# Altium schematic sheet Sheet2.SchDoc
size A4; SheetNumber: 3; SheetTotal: 3
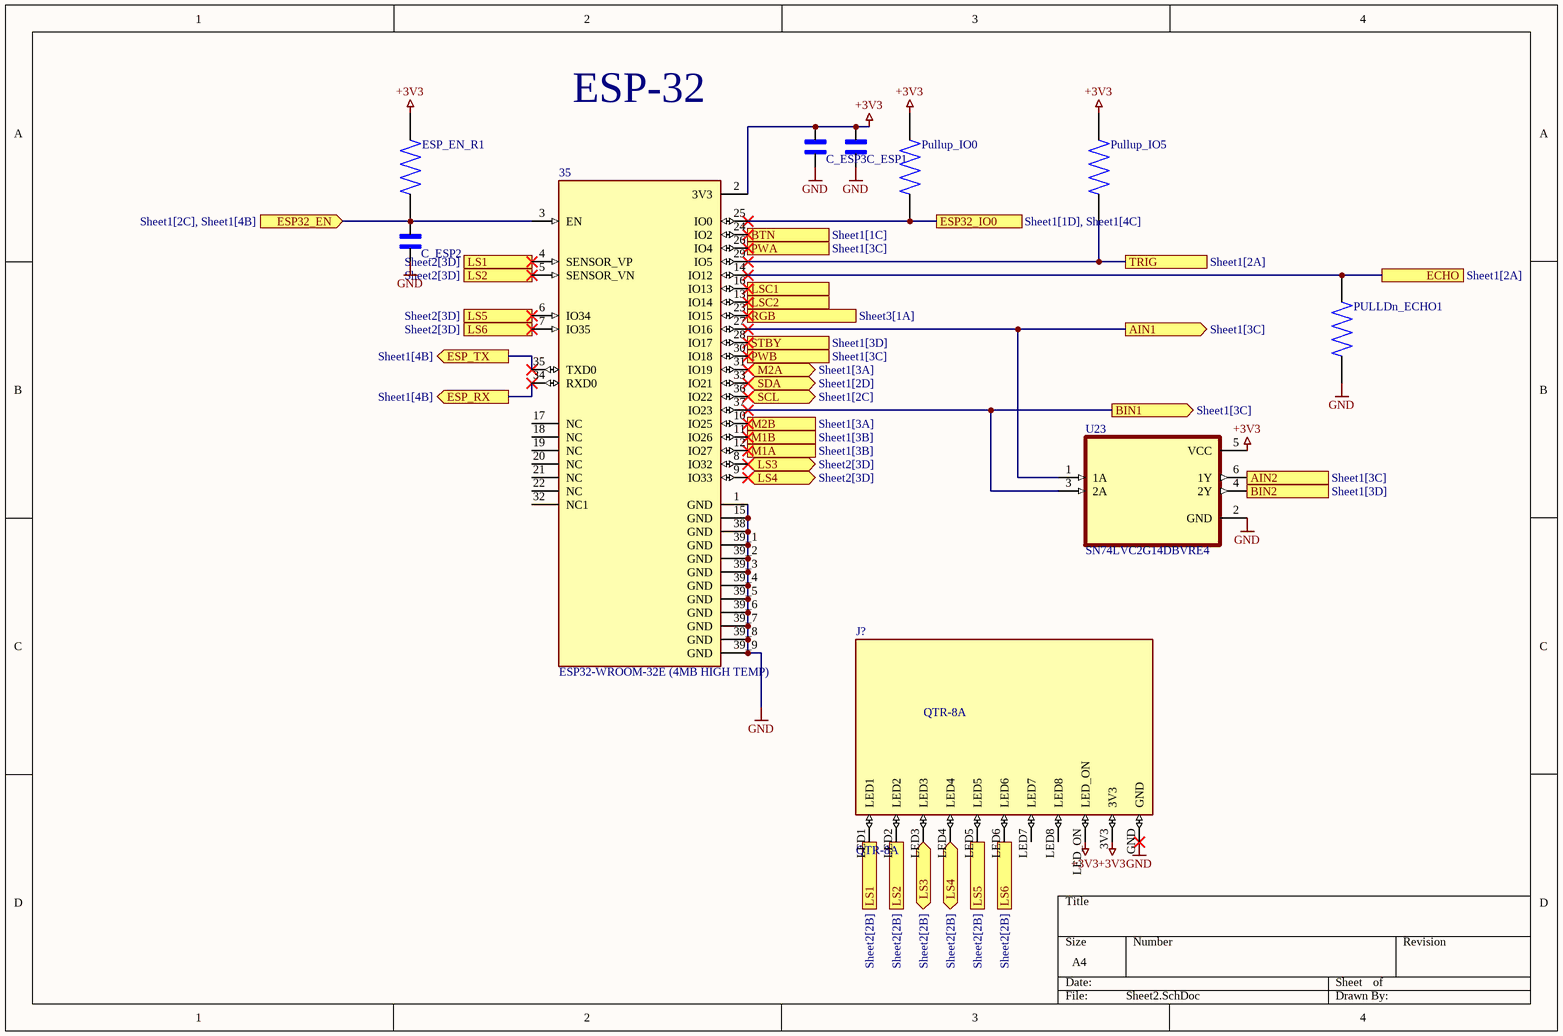
[diagram p0: Sheet2.SchDoc]

## Parts
35  ESP32-WROOM-32E (4MB HIGH TEMP)  [XCVR_ESP32-WROOM-32E_(4MB_HIGH_TEMP)]
C_ESP1  GRM033R61C224ME14D  [CAPC0603X33N]  (value not drawn)
C_ESP2  GRM033R61C224ME14D  [CAPC0603X33N]  (value not drawn)
C_ESP3  GRM033R61C224ME14D  [CAPC0603X33N]  (value not drawn)
ESP_EN_R1  CRG0402F4K7  [RESC1005X40N]  (value not drawn)
J?  QTR-8A  [QTR-8A]
PULLDn_ECHO1  CRG0402F4K7  [RESC1005X40N]  (value not drawn)
Pullup_IO0  CRG0402F4K7  [RESC1005X40N]  (value not drawn)
Pullup_IO5  CRG0402F4K7  [RESC1005X40N]  (value not drawn)
U23  SN74LVC2G14DBVRE4  [SOT95P280X145-6N]

## Ports
AIN1 (out, see Sheet1[3C]), AIN2 (out, see Sheet1[3C]), BIN1 (out, see Sheet1[3C]), BIN2 (out, see Sheet1[3D]), BTN (see Sheet1[1C]), ECHO (see Sheet1[2A]), ESP32_EN (in, see Sheet1[2C], Sheet1[4B]), ESP32_IO0 (see Sheet1[1D], Sheet1[4C]), ESP_RX (out, see Sheet1[4B]), ESP_TX (out, see Sheet1[4B]), LS1 (see Sheet2[2B]), LS1 (see Sheet2[3D]), LS2 (see Sheet2[2B]), LS2 (see Sheet2[3D]), LS3 (bidir, see Sheet2[2B]), LS3 (bidir, see Sheet2[3D]), LS4 (bidir, see Sheet2[2B]), LS4 (bidir, see Sheet2[3D]), LS5 (see Sheet2[2B]), LS5 (see Sheet2[3D]), LS6 (see Sheet2[2B]), LS6 (see Sheet2[3D]), LSC1, LSC2, M1A (see Sheet1[3B]), M1B (see Sheet1[3B]), M2A (bidir, see Sheet1[3A]), M2B (see Sheet1[3A]), PWA (out, see Sheet1[3C]), PWB (out, see Sheet1[3C]), RGB (out, see Sheet3[1A]), SCL (bidir, see Sheet1[2C]), SDA (bidir, see Sheet1[2D]), STBY (out, see Sheet1[3D]), TRIG (see Sheet1[2A])

## Nets
+3V3: 35.2(3V3) C_ESP1.2 C_ESP3.2 ESP_EN_R1.2 J?.3V3 J?.LED_ON Pullup_IO0.2 Pullup_IO5.2 U23.5(VCC)
GND: 35.1(GND) 35.15(GND) 35.38(GND) 35.39_1(GND) 35.39_2(GND) 35.39_3(GND) 35.39_4(GND) 35.39_5(GND) 35.39_6(GND) 35.39_7(GND) 35.39_8(GND) 35.39_9(GND) C_ESP1.1 C_ESP2.1 C_ESP3.1 J?.GND PULLDn_ECHO1.1 U23.2(GND)
AIN1: 35.27(IO16) U23.1(1A) ; port AIN1
AIN2: U23.6(1Y) ; port AIN2
BIN1: 35.37(IO23) U23.3(2A) ; port BIN1
BIN2: U23.4(2Y) ; port BIN2
BTN: 35.24(IO2) ; port BTN
ECHO: 35.14(IO12) PULLDn_ECHO1.2 ; port ECHO
ESP32_EN: 35.3(EN) C_ESP2.2 ESP_EN_R1.1 ; port ESP32_EN
ESP32_IO0: 35.25(IO0) Pullup_IO0.1 ; port ESP32_IO0
ESP_RX: 35.34(RXD0) ; port ESP_RX
ESP_TX: 35.35(TXD0) ; port ESP_TX
LS1: 35.4(SENSOR_VP) J?.LED1 ; port LS1
LS2: 35.5(SENSOR_VN) J?.LED2 ; port LS2
LS3: 35.8(IO32) J?.LED3 ; port LS3
LS4: 35.9(IO33) J?.LED4 ; port LS4
LS5: 35.6(IO34) J?.LED5 ; port LS5
LS6: 35.7(IO35) J?.LED6 ; port LS6
LSC1: 35.16(IO13) ; port LSC1
LSC2: 35.13(IO14) ; port LSC2
M1A: 35.12(IO27) ; port M1A
M1B: 35.11(IO26) ; port M1B
M2A: 35.31(IO19) ; port M2A
M2B: 35.10(IO25) ; port M2B
PWA: 35.26(IO4) ; port PWA
PWB: 35.30(IO18) ; port PWB
RGB: 35.23(IO15) ; port RGB
SCL: 35.36(IO22) ; port SCL
SDA: 35.33(IO21) ; port SDA
STBY: 35.28(IO17) ; port STBY
TRIG: 35.29(IO5) Pullup_IO5.1 ; port TRIG

Not connected (* = marked no-connect by the designer): 35 17(NC) 18(NC) 19(NC) 20(NC) 21(NC) 22(NC) 32(NC1); J? LED7 LED8

## Notes on the sheet
- ESP-32

## Library data of the parts
35 = ESP32-WROOM-32E (4MB HIGH TEMP): MF: Espressif Systems; Package: SMD-44 Espressif Systems; Check_prices: https://www.snapeda.com/parts/ESP32-WROOM-32E%20(4MB%20HIGH%20TEMP)/Espressif+Systems/view-part/?ref=eda; Value: *; Price: None; MP: ESP32-WROOM-32E (4MB HIGH TEMP); Purchase-URL: https://pricing.snapeda.com/search/part/ESP32-WROOM-32E (4MB HIGH TEMP)/?ref=eda; SnapEDA_Link: https://www.snapeda.com/parts/ESP32-WROOM-32E%20(4MB%20HIGH%20TEMP)/Espressif+Systems/view-part/?ref=snap; Availability: In Stock; ID: ESP32-WROOM-32E (4MB HIGH TEMP); Supplier 1: Digikey; Supplier Part Number 1: 1904-ESP32-WROOM-32E(M113EH3200PH3Q0)TR-ND
C_ESP1 = GRM033R61C224ME14D: 0603; Value: 1µ; MF: Murata; SnapEDA_Link: https://www.snapeda.com/parts/GRM033R61C224ME14D/Murata/view-part/?ref=snap; Package: 0603 Murata; MP: GRM033R61C224ME14D; Check_prices: https://www.snapeda.com/parts/GRM033R61C224ME14D/Murata/view-part/?ref=eda; ID: GRM033R61C224ME14D; Supplier 1: Avnet; Supplier Part Number 1: LMK107B7105KA-T; Supplier 2: Mouser; Supplier Part Number 2: 81-GCM188R71E105KA4D
C_ESP2 = GRM033R61C224ME14D: 0603 100n; MF: Murata; SnapEDA_Link: https://www.snapeda.com/parts/GRM033R61C224ME14D/Murata/view-part/?ref=snap; Package: 0603 Murata; Value: 100n; MP: GRM033R61C224ME14D; Check_prices: https://www.snapeda.com/parts/GRM033R61C224ME14D/Murata/view-part/?ref=eda; ID: GRM033R61C224ME14D; Supplier 1: Mouser; Supplier Part Number 1: 81-GRM033R61C224ME4D
C_ESP3 = GRM033R61C224ME14D: 0603; Value: 10µ; MF: Murata; SnapEDA_Link: https://www.snapeda.com/parts/GRM033R61C224ME14D/Murata/view-part/?ref=snap; Package: 0603 Murata; MP: GRM033R61C224ME14D; Check_prices: https://www.snapeda.com/parts/GRM033R61C224ME14D/Murata/view-part/?ref=eda; ID: GRM033R61C224ME14D; Supplier 1: Mouser; Supplier Part Number 1: 810-C1608X5R1E225K
ESP_EN_R1 = CRG0402F4K7: Thick Film Smnt Resistor 0402 Case 10kOhm +/-1% 0.063W +/-100ppm/degC | TE Connectivity; Power_Rating: .063 W; Resistance: 10k; Voltage_Rating: 50 V; Tolerance: 1%; SnapEDA_Link: https://www.snapeda.com/parts/CRG0402F4K7/TE+Connectivity+Passive+Product/view-part/?ref=snap; Package: 0402; Value: *; MF: TE Connectivity; MP: CRG0402F4K7; Check_prices: https://www.snapeda.com/parts/CRG0402F4K7/TE+Connectivity+Passive+Product/view-part/?ref=eda; Supplier 1: Avnet; Supplier Part Number 1: RC1005F1002CS; Supplier 2: Mouser; Supplier Part Number 2: 667-ERT-J0ER103J; Supplier 3: Farnell; Supplier Part Number 3: 2072516RL
J? = QTR-8A: QRE1113GR series Phototransistor Sensor Evaluation Board; MF: Pololu; SnapEDA_Link: https://www.snapeda.com/parts/QTR-8A/Pololu/view-part/?ref=snap; Package: None; Value: *; MP: QTR-8A; Check_prices: https://www.snapeda.com/parts/QTR-8A/Pololu/view-part/?ref=eda
PULLDn_ECHO1 Pullup_IO0 = CRG0402F4K7: Thick Film Smnt Resistor 0402 Case 4.7kOhm +/-1% 0.063W +/-100ppm/degC | TE Connectivity CRG0402F4K7; Power_Rating: .063 W; Resistance: 10k; Voltage_Rating: 50 V; Tolerance: 1%; SnapEDA_Link: https://www.snapeda.com/parts/CRG0402F4K7/TE+Connectivity+Passive+Product/view-part/?ref=snap; Package: 0402; Value: *; MF: TE Connectivity; MP: CRG0402F4K7; Check_prices: https://www.snapeda.com/parts/CRG0402F4K7/TE+Connectivity+Passive+Product/view-part/?ref=eda
  PULLDn_ECHO1: Supplier 1: Mouser; Supplier Part Number 1: 81-NCP15XV103J03RC
Pullup_IO5 = CRG0402F4K7: Thick Film Smnt Resistor 0402 Case 10kOhm +/-1% 0.063W +/-100ppm/degC | TE Connectivity CRG0402F4K7; Power_Rating: .063 W; Resistance: 10k; Voltage_Rating: 50 V; Tolerance: 1%; SnapEDA_Link: https://www.snapeda.com/parts/CRG0402F4K7/TE+Connectivity+Passive+Product/view-part/?ref=snap; Package: 0402; Value: *; MF: TE Connectivity; MP: CRG0402F4K7; Check_prices: https://www.snapeda.com/parts/CRG0402F4K7/TE+Connectivity+Passive+Product/view-part/?ref=eda; Supplier 1: Mouser; Supplier Part Number 1: 81-NCP15XV103J03RC
U23 = SN74LVC2G14DBVRE4: Dual Schmitt-Trigger Inverter 6-SOT-23 -40 to 125; MF: Texas Instruments; Price: None; Availability: In Stock; Check_prices: https://www.snapeda.com/parts/SN74LVC2G14DBVRE4/Texas+Instruments/view-part/?ref=eda; MP: SN74LVC2G14DBVRE4; Package: SOT-23-6 Texas Instruments; SnapEDA_Link: https://www.snapeda.com/parts/SN74LVC2G14DBVRE4/Texas+Instruments/view-part/?ref=snap; Value: *; Purchase-URL: https://pricing.snapeda.com/search/part/SN74LVC2G14DBVRE4/?ref=eda; Supplier 1: Mouser; Supplier Part Number 1: 595-SN74LVC2G14DBVE4